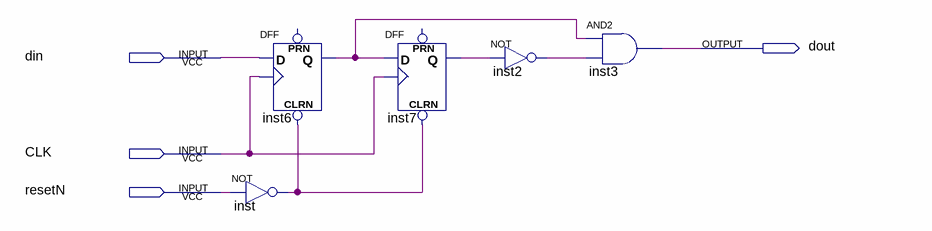
[diagram p0: schematic sheet]
// Quartus schematic gozer_up.bdf as structural Verilog: 5 symbols, 4 pins
module gozer_up (
  input  din,
  input  CLK,
  input  resetN,
  output dout
);

  wire inst2_out, inst6_q, inst7_q, inst_out;

  DFF inst6 (.CLRN(inst_out), .CLK(CLK), .D(din), .Q(inst6_q));  // open: PRN
  not inst (inst_out, resetN);
  DFF inst7 (.CLRN(inst_out), .CLK(CLK), .D(inst6_q), .Q(inst7_q));  // open: PRN
  not inst2 (inst2_out, inst7_q);
  and inst3 (dout, inst6_q, inst2_out);
endmodule
